# Altium project PCB_Project_DoubleBLDC.PrjPcb
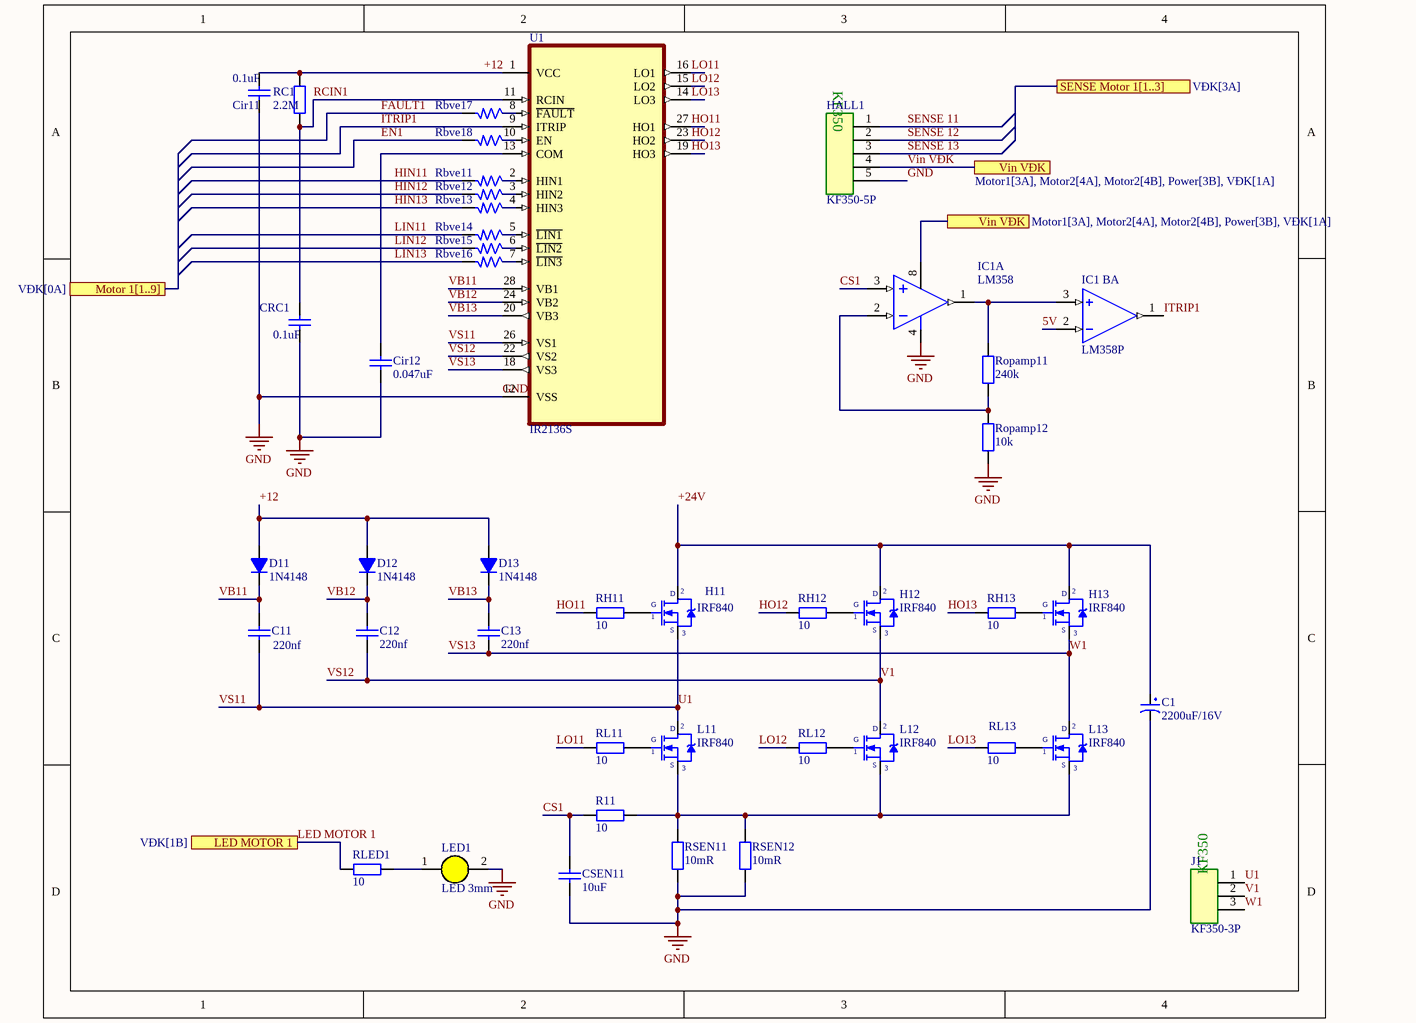
[diagram p0: Motor1.SchDoc]
4 sheets, 105 parts. Net scope: global (net labels, ports and power ports of the same name join across sheets).
Board file: DoubleBLDC.PcbDoc
Sheets:
  Motor1.SchDoc
  Motor2.SchDoc
  Power.SchDoc
  VĐK.SchDoc

## Sheet Motor1.SchDoc
size A; SheetNumber: 1; SheetTotal: 4

### Parts
C1  2200uF/16V  [CP2/4]
C11  value 220nf  [Tu-pico]  (hidden comment: Capacitor Ceramic)
C12  value 220nf  [Tu-pico]  (hidden comment: Capacitor Ceramic)
C13  value 220nf  [Tu-pico]  (hidden comment: Capacitor Ceramic)
Cir11  value 0.1uF  [Tu-pico]  (hidden comment: Capacitor Ceramic)
Cir12  value 0.047uF  [Tu-pico]  (hidden comment: Capacitor Ceramic)
CRC1  value 0.1uF  [Tu-pico]  (hidden comment: Capacitor Ceramic)
CSEN11  value 10uF  [Tu-pico]  (hidden comment: Capacitor Ceramic)
D11  1N4148  [D0.5A]
D12  1N4148  [D0.5A]
D13  1N4148  [D0.5A]
H11  IRF840  [QTO-220]
H12  IRF840  [QTO-220]
H13  IRF840  [QTO-220]
HALL1  KF350-5P  [KF350-5P]
IC1  LM358  [DIP8/W0.3]  (part A of 2)
IC1_B  LM358P  [DIP794W45P254L959H508Q8]  (part A of 3)
J1  KF350-3P  [KF350-3P]
L11  IRF840  [QTO-220]
L12  IRF840  [QTO-220]
L13  IRF840  [QTO-220]
LED1  LED 3mm  [LED-3MM-YELLOW]
R11  10  [R1/4W]
Rbve11  1m  [SM-1206]  (value not drawn)
Rbve12  1m  [SM-1206]  (value not drawn)
Rbve13  1m  [SM-1206]  (value not drawn)
Rbve14  1m  [SM-1206]  (value not drawn)
Rbve15  1m  [SM-1206]  (value not drawn)
Rbve16  1m  [SM-1206]  (value not drawn)
Rbve17  1m  [SM-1206]  (value not drawn)
Rbve18  1m  [SM-1206]  (value not drawn)
RC1  2.2M  [R1/4W]
RH11  10  [R1/4W]
RH12  10  [R1/4W]
RH13  10  [R1/4W]
RL11  10  [R1/4W]
RL12  10  [R1/4W]
RL13  10  [R1/4W]
RLED1  10  [R1/4W]
Ropamp11  240k  [R1/4W]
Ropamp12  10k  [R1/4W]
RSEN11  10mR  [Shunt 10mR 1.2x10x7MM]
RSEN12  10mR  [Shunt 10mR 1.2x10x7MM]
U1  IR2136S  [SOIC127PX1032X265-28N]

### Ports
LED MOTOR 1 (see VĐK[1B]), Motor 1[1..9] (see VĐK[0A]), SENSE Motor 1[1..3] (see VĐK[3A]), Vin VĐK (see Motor1[3A], Motor2[4A], Motor2[4B], Power[3B], VĐK[1A])

### Nets
GND: C1.2 Cir11.2 Cir12.2 CRC1.2 CSEN11.2 HALL1.5 IC1.4(-V) LED1.2(K) Ropamp12.2 RSEN11.1 RSEN12.1 U1.12(VSS)
5V: IC1_B.2(-IN1)
+12: Cir11.1 D11.1(A) D12.1(A) D13.1(A) RC1.2 U1.1(VCC)
+24V: C1.1 H11.2(D) H12.2(D) H13.2(D)
CS1: CSEN11.1 IC1.3(IN+) R11.2
EN1: Rbve18.2
FAULT1: Rbve17.2
HIN11: Rbve11.2
HIN12: Rbve12.2
HIN13: Rbve13.2
HO11: RH11.1 U1.27(HO1)
HO12: RH12.1 U1.23(HO2)
HO13: RH13.1 U1.19(HO3)
ITRIP1: IC1_B.1(OUT1) U1.9(ITRIP)
LED MOTOR 1: RLED1.2 ; port LED MOTOR 1
LIN11: Rbve14.2
LIN12: Rbve15.2
LIN13: Rbve16.2
LO11: RL11.1 U1.16(LO1)
LO12: RL12.1 U1.15(LO2)
LO13: RL13.2 U1.14(LO3)
RCIN1: CRC1.1 RC1.1 U1.11(RCIN)
SENSE 11: HALL1.1
SENSE 12: HALL1.2
SENSE 13: HALL1.3
U1: C11.2 H11.3(S) J1.1 L11.2(D) U1.26(VS1)  [also labelled VS11]
V1: C12.2 H12.3(S) J1.2 L12.2(D) U1.22(VS2)  [also labelled VS12]
VB11: C11.1 D11.2(K) U1.28(VB1)
VB12: C12.1 D12.2(K) U1.24(VB2)
VB13: C13.1 D13.2(K) U1.20(VB3)
Vin VĐK: HALL1.4 IC1.8(+V) ; port Vin VĐK
VS13: C13.2 H13.3(S) J1.3 L13.2(D) U1.18(VS3)  [also labelled W1]
NetCir12_1: Cir12.1 U1.13(COM)
NetH11_1: H11.1(G) RH11.2
NetH12_1: H12.1(G) RH12.2
NetH13_1: H13.1(G) RH13.2
NetIC1_1: IC1.1(OUT) IC1_B.3(+IN1) Ropamp11.1
NetIC1_2: IC1.2(IN-) Ropamp11.2 Ropamp12.1
NetL11_1: L11.1(G) RL11.2
NetL11_3: L11.3(S) L12.3(S) L13.3(S) R11.1 RSEN11.2 RSEN12.2
NetL12_1: L12.1(G) RL12.2
NetL13_1: L13.1(G) RL13.1
NetLED1_1: LED1.1(A) RLED1.1
NetRbve11_1: Rbve11.1 U1.2(HIN1)
NetRbve12_1: Rbve12.1 U1.3(HIN2)
NetRbve13_1: Rbve13.1 U1.4(HIN3)
NetRbve14_1: Rbve14.1 U1.5(~{LIN1})
NetRbve15_1: Rbve15.1 U1.6(~{LIN2})
NetRbve16_1: Rbve16.1 U1.7(~{LIN3})
NetRbve17_1: Rbve17.1 U1.8(~{FAULT})
NetRbve18_1: Rbve18.1 U1.10(EN)

### Notes on the sheet
- (in symbol KF350-3P) KF350
- (in symbol KF350-5P) KF350

### Library data of the parts
C1 = CP5: Cap 2200uF/16V - 1000uF/50V; Description 5: 47uF/200V - 22uF/350V - 400V - 10uF/450V; Description 1: 4700uF-6800uF/6,3V - 3300uF-4700uF/10V; Description 2: 2200uF-3300uF/16V - 470uF => 2200uF/25V; Description 3: 1000uF/35V-50V_470uF/63V_220uF>330uF/100V; Description 4: 47uF => 100uF/160V - 33uF-47uF/250V; Value: 2200uF/16V
C11-C13 Cir11 Cir12 CRC1 CSEN11 = CapCeramic: Capacitor; Published: 8-Jun-2000; LatestRevisionDate: 17-Jul-2002; LatestRevisionNote: Re-released for DXP Platform.; PackageReference: RAD-0.3; Publisher: Altium Limited
D11-D13 = D0.5A: Value: 1N4148
H11-H13 L11-L13 = IRF840: MOSFET N - CHANNEL 500V - 0.75 - 8A - TO-220; Value: IRF840
IC1 = LM358: Low-Power Dual Operational Amplifier; Value: LM358
IC1_B = LM358P: Dual, 30-V, 700-kHz operational amplifier; MF: Texas Instruments; SnapEDA_Link: https://www.snapeda.com/parts/LM358P/Texas+Instruments/view-part/?ref=snap; Package: PDIP-8 Texas; Value: *; MP: LM358P; Check_prices: https://www.snapeda.com/parts/LM358P/Texas+Instruments/view-part/?ref=eda
LED1 = LED 3mm Vang: Cắm; Don_Vi: Con; Ma_Hang: MH003893; Ten_Linh_Kien: Led 3MM Phủ Vàng (10c); Ghi_Chu: *; Kieu_Chan: *; Chung_Loai: Cắm
R11 RC1 RH11-RH13 RL11-RL13 RLED1 Ropamp11 Ropamp12 = R1/4W: Resistor 1/4W; Value: R1/4W - 1K
Rbve11-Rbve18 = R: Resistor 1/4W; Value: R1/4W - 1K
RSEN11 RSEN12 = Shunt 10mR 1.2x10x7MM
U1 = IR2136S: IC Ä‘iá»u khiá»ƒn ná»­a cáº§u cá»•ng Ä‘áº£o ngÆ°á»£c 28-SOIC; MF: Infineon; Package: SOIC-28 Infineon; Availability: Unavailable; MP: IR2136S; Value: *; SnapEDA_Link: https://www.snapeda.com/parts/IR2136S/Infineon%20Technologies/view-part/652863/?ref=snap; Price: None

## Sheet Motor2.SchDoc
size A; SheetNumber: 2; SheetTotal: 4
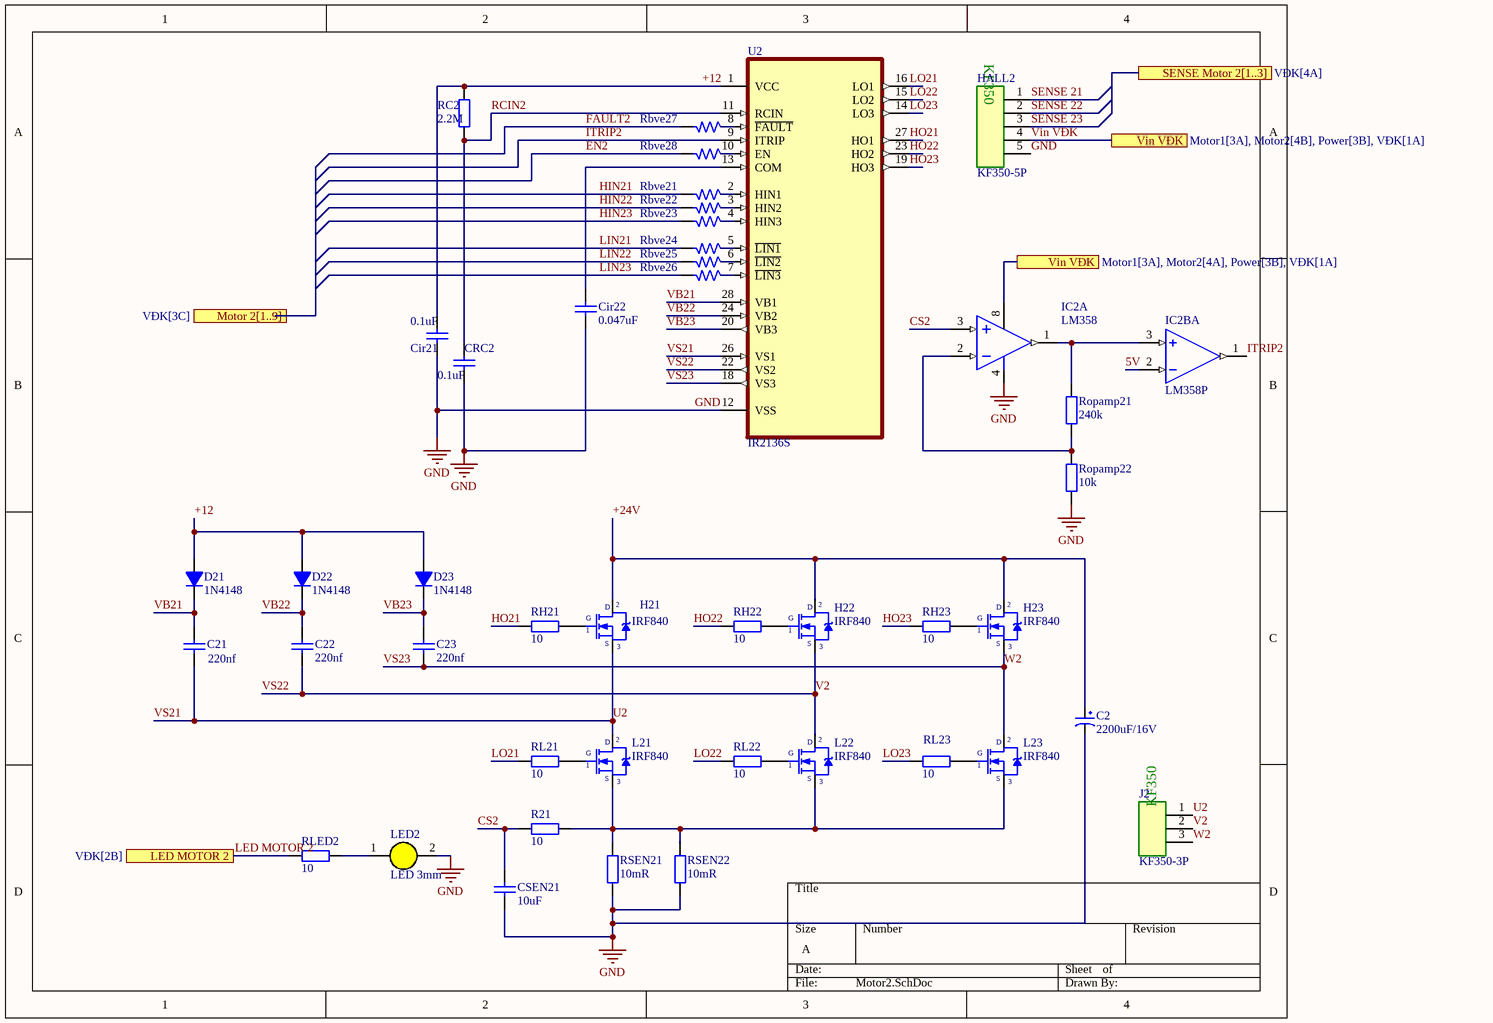
[diagram p1: Motor2.SchDoc]

### Parts
C2  2200uF/16V  [CP2/4]
C21  value 220nf  [Tu-pico]  (hidden comment: Capacitor Ceramic)
C22  value 220nf  [Tu-pico]  (hidden comment: Capacitor Ceramic)
C23  value 220nf  [Tu-pico]  (hidden comment: Capacitor Ceramic)
Cir21  value 0.1uF  [Tu-pico]  (hidden comment: Capacitor Ceramic)
Cir22  value 0.047uF  [Tu-pico]  (hidden comment: Capacitor Ceramic)
CRC2  value 0.1uF  [Tu-pico]  (hidden comment: Capacitor Ceramic)
CSEN21  value 10uF  [Tu-pico]  (hidden comment: Capacitor Ceramic)
D21  1N4148  [D0.5A]
D22  1N4148  [D0.5A]
D23  1N4148  [D0.5A]
H21  IRF840  [QTO-220]
H22  IRF840  [QTO-220]
H23  IRF840  [QTO-220]
HALL2  KF350-5P  [KF350-5P]
IC2  LM358  [DIP8/W0.3]  (part A of 2)
IC2B  LM358P  [DIP794W45P254L959H508Q8]  (part A of 3)
J2  KF350-3P  [KF350-3P]
L21  IRF840  [QTO-220]
L22  IRF840  [QTO-220]
L23  IRF840  [QTO-220]
LED2  LED 3mm  [LED-3MM-YELLOW]
R21  10  [R1/4W]
Rbve21  1m  [SM-1206]  (value not drawn)
Rbve22  1m  [SM-1206]  (value not drawn)
Rbve23  1m  [SM-1206]  (value not drawn)
Rbve24  1m  [SM-1206]  (value not drawn)
Rbve25  1m  [SM-1206]  (value not drawn)
Rbve26  1m  [SM-1206]  (value not drawn)
Rbve27  1m  [SM-1206]  (value not drawn)
Rbve28  1m  [SM-1206]  (value not drawn)
RC2  2.2M  [R1/4W]
RH21  10  [R1/4W]
RH22  10  [R1/4W]
RH23  10  [R1/4W]
RL21  10  [R1/4W]
RL22  10  [R1/4W]
RL23  10  [R1/4W]
RLED2  10  [R1/4W]
Ropamp21  240k  [R1/4W]
Ropamp22  10k  [R1/4W]
RSEN21  10mR  [Shunt 10mR 1.2x10x7MM]
RSEN22  10mR  [Shunt 10mR 1.2x10x7MM]
U2  IR2136S  [SOIC127PX1032X265-28N]

### Ports
LED MOTOR 2 (see VĐK[2B]), Motor 2[1..9] (see VĐK[3C]), SENSE Motor 2[1..3] (see VĐK[4A]), Vin VĐK (see Motor1[3A], Motor2[4A], Power[3B], VĐK[1A]), Vin VĐK (see Motor1[3A], Motor2[4B], Power[3B], VĐK[1A])

### Nets
GND: C2.2 Cir21.2 Cir22.2 CRC2.2 CSEN21.2 HALL2.5 IC2.4(-V) LED2.2(K) Ropamp22.2 RSEN21.1 RSEN22.1 U2.12(VSS)
5V: IC2B.2(-IN1)
+12: Cir21.1 D21.1(A) D22.1(A) D23.1(A) RC2.2 U2.1(VCC)
+24V: C2.1 H21.2(D) H22.2(D) H23.2(D)
CS2: CSEN21.1 IC2.3(IN+) R21.2
EN2: Rbve28.2
FAULT2: Rbve27.2
HIN21: Rbve21.2
HIN22: Rbve22.2
HIN23: Rbve23.2
HO21: RH21.1 U2.27(HO1)
HO22: RH22.1 U2.23(HO2)
HO23: RH23.1 U2.19(HO3)
ITRIP2: IC2B.1(OUT1) U2.9(ITRIP)
LED MOTOR 2: RLED2.2 ; port LED MOTOR 2
LIN21: Rbve24.2
LIN22: Rbve25.2
LIN23: Rbve26.2
LO21: RL21.1 U2.16(LO1)
LO22: RL22.1 U2.15(LO2)
LO23: RL23.2 U2.14(LO3)
RCIN2: CRC2.1 RC2.1 U2.11(RCIN)
SENSE 21: HALL2.1
SENSE 22: HALL2.2
SENSE 23: HALL2.3
U2: C21.2 H21.3(S) J2.1 L21.2(D) U2.26(VS1)  [also labelled VS21]
V2: C22.2 H22.3(S) J2.2 L22.2(D) U2.22(VS2)  [also labelled VS22]
VB21: C21.1 D21.2(K) U2.28(VB1)
VB22: C22.1 D22.2(K) U2.24(VB2)
VB23: C23.1 D23.2(K) U2.20(VB3)
Vin VĐK: HALL2.4 IC2.8(+V) ; port Vin VĐK
VS23: C23.2 H23.3(S) J2.3 L23.2(D) U2.18(VS3)  [also labelled W2]
NetCir22_1: Cir22.1 U2.13(COM)
NetH21_1: H21.1(G) RH21.2
NetH22_1: H22.1(G) RH22.2
NetH23_1: H23.1(G) RH23.2
NetIC2_1: IC2.1(OUT) IC2B.3(+IN1) Ropamp21.1
NetIC2_2: IC2.2(IN-) Ropamp21.2 Ropamp22.1
NetL21_1: L21.1(G) RL21.2
NetL21_3: L21.3(S) L22.3(S) L23.3(S) R21.1 RSEN21.2 RSEN22.2
NetL22_1: L22.1(G) RL22.2
NetL23_1: L23.1(G) RL23.1
NetLED2_1: LED2.1(A) RLED2.1
NetRbve21_1: Rbve21.1 U2.2(HIN1)
NetRbve22_1: Rbve22.1 U2.3(HIN2)
NetRbve23_1: Rbve23.1 U2.4(HIN3)
NetRbve24_1: Rbve24.1 U2.5(~{LIN1})
NetRbve25_1: Rbve25.1 U2.6(~{LIN2})
NetRbve26_1: Rbve26.1 U2.7(~{LIN3})
NetRbve27_1: Rbve27.1 U2.8(~{FAULT})
NetRbve28_1: Rbve28.1 U2.10(EN)

### Notes on the sheet
- (in symbol KF350-3P) KF350
- (in symbol KF350-5P) KF350

### Library data of the parts
C2 = CP5: as C1 on sheet Motor1; Value: 2200uF/16V
C21-C23 Cir21 Cir22 CRC2 CSEN21 = CapCeramic: Capacitor; Published: 8-Jun-2000; LatestRevisionDate: 17-Jul-2002; LatestRevisionNote: Re-released for DXP Platform.; PackageReference: RAD-0.3; Publisher: Altium Limited
D21-D23 = D0.5A: Value: 1N4148
H21-H23 L21-L23 = IRF840: as H11 on sheet Motor1; Value: IRF840
IC2 = LM358: Low-Power Dual Operational Amplifier; Value: LM358
IC2B = LM358P: as IC1_B on sheet Motor1; SnapEDA_Link: https://www.snapeda.com/parts/LM358P/Texas+Instruments/view-part/?ref=snap; Package: PDIP-8 Texas; Value: *; MP: LM358P; Check_prices: https://www.snapeda.com/parts/LM358P/Texas+Instruments/view-part/?ref=eda
LED2 = LED 3mm Vang: as LED1 on sheet Motor1; Ghi_Chu: *; Kieu_Chan: *; Chung_Loai: Cắm
R21 RC2 RH21-RH23 RL21-RL23 RLED2 Ropamp21 Ropamp22 = R1/4W: Resistor 1/4W; Value: R1/4W - 1K
Rbve21-Rbve28 = R: Resistor 1/4W; Value: R1/4W - 1K
RSEN21 RSEN22 = Shunt 10mR 1.2x10x7MM
U2 = IR2136S: as U1 on sheet Motor1; Package: SOIC-28 Infineon; Availability: Unavailable; MP: IR2136S; Value: *; SnapEDA_Link: https://www.snapeda.com/parts/IR2136S/Infineon%20Technologies/view-part/652863/?ref=snap; Price: None

## Sheet Power.SchDoc
size A; SheetNumber: 3; SheetTotal: 4
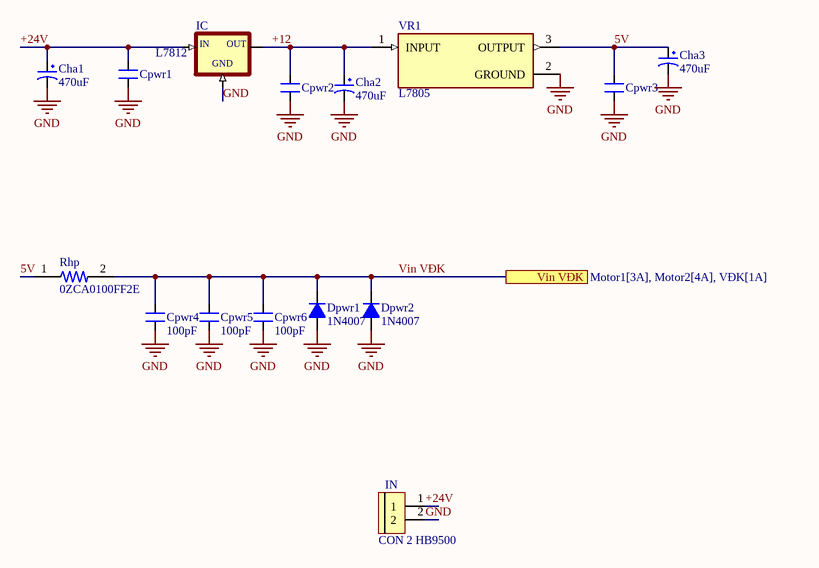
[diagram p2: Power.SchDoc]

### Parts
Cha1  470uF  [CP1.5/3.4]
Cha2  470uF  [CP1.5/3.4]
Cha3  470uF  [CP1.5/3.4]
Cpwr1  100pF  [CN1]  (value not drawn)
Cpwr2  100pF  [CN1]  (value not drawn)
Cpwr3  100pF  [CN1]  (value not drawn)
Cpwr4  100pF  [CN1]
Cpwr5  100pF  [CN1]
Cpwr6  100pF  [CN1]
Dpwr1  1N4007  [D0.5A]
Dpwr2  1N4007  [D0.5A]
IC  L7812  [78XXS]
IN  CON 2 HB9500  [CON 2 HB9500]
Rhp  0ZCA0100FF2E  [RESC3216X125N]
VR1  L7805  [TO255P1020X450X2000-3]

### Ports
Vin VĐK (see Motor1[3A], Motor2[4A], VĐK[1A])

### Nets
GND: Cha1.2 Cha2.2 Cha3.2 Cpwr1.2 Cpwr2.2 Cpwr3.2 Cpwr4.2 Cpwr5.2 Cpwr6.2 Dpwr1.1(A) Dpwr2.1(A) IC.GND IN.2 VR1.2(GROUND)
5V: Cha3.1 Cpwr3.1 Rhp.1 VR1.3(OUTPUT)
+12: Cha2.1 Cpwr2.1 IC.OUT VR1.1(INPUT)
+24V: Cha1.1 Cpwr1.1 IC.IN IN.1
Vin VĐK: Cpwr4.1 Cpwr5.1 Cpwr6.1 Dpwr1.2(K) Dpwr2.2(K) Rhp.2 ; port Vin VĐK

### Library data of the parts
Cha1-Cha3 = CP4: Cap 1000uF/16V - 220uF/50V; Description 5: 4,7uF>10uF/250V_3,3uF>10uF/400V - 2,2uF>4,7uF/450V; Description 1: 2200uF-3300uF/6,3V - 1000uF-2200uF/10V; Description 2: 1000uF/16V - 470uF => 1000uF/25V - 100uF/100V; Description 3: 330uF>470uF/35V_220uF>470uF/50V_10uF>22uF/250V; Description 4: 220uF => 330uF/63V - 10uF =>33uF/160 - 200V; Value: 1000uF/16V
Cpwr1-Cpwr6 = CN1: Cap np  1pF - 472pF; Value: 100pF
Dpwr1 Dpwr2 = D1A: Diode 1A; Value: 1N4007
IC = L7812: Linear Voltage Regulator IC 1 Output 1.5A D2PAK; MF: STMicroelectronics; Value: *; SnapEDA_Link: https://www.snapeda.com/parts/L7812/STMicroelectronics/view-part/562240/?ref=snap; Package: D2PAK STMicroelectronics; MP: L7812; Availability: Unavailable; Price: None
IN = CON 2 HB9500: Cắm; Ma_Hang: MH002054; Ten_Linh_Kien: CON 2 HB9500-2P 9.5MM; Chung_Loai: Cắm; Ghi_Chu: *; Kieu_Chan: *; Don_Vi: Con
Rhp = 0ZCA0100FF2E: Polymeric PTC Resettable Fuse 6V 1 A Ih Surface Mount 1206 (3216 Metric), Concave; MF: Bel Fuse; Check_prices: https://www.snapeda.com/parts/0ZCA0100FF2E/Bel+Fuse+Inc./view-part/?ref=eda; Value: *; Availability: In Stock; MP: 0ZCA0100FF2E; Price: None; Package: 1206 Bel Fuse; SnapEDA_Link: https://www.snapeda.com/parts/0ZCA0100FF2E/Bel+Fuse+Inc./view-part/?ref=snap; Purchase-URL: https://pricing.snapeda.com/search/part/0ZCA0100FF2E/?ref=eda
VR1 = L7805: Standard Regulator Pos 5V 1.5A 3-Pin(3+Tab) TO-220FP Tube; MF: STMicroelectronics; MP: L7805; Value: *; SnapEDA_Link: https://www.snapeda.com/parts/L7805/STMicroelectronics/view-part/?ref=snap; Price: None; Package: None; Check_prices: https://www.snapeda.com/parts/L7805/STMicroelectronics/view-part/?ref=eda; Availability: Not in stock

## Sheet VĐK.SchDoc
size A4; SheetNumber: 4; SheetTotal: 4
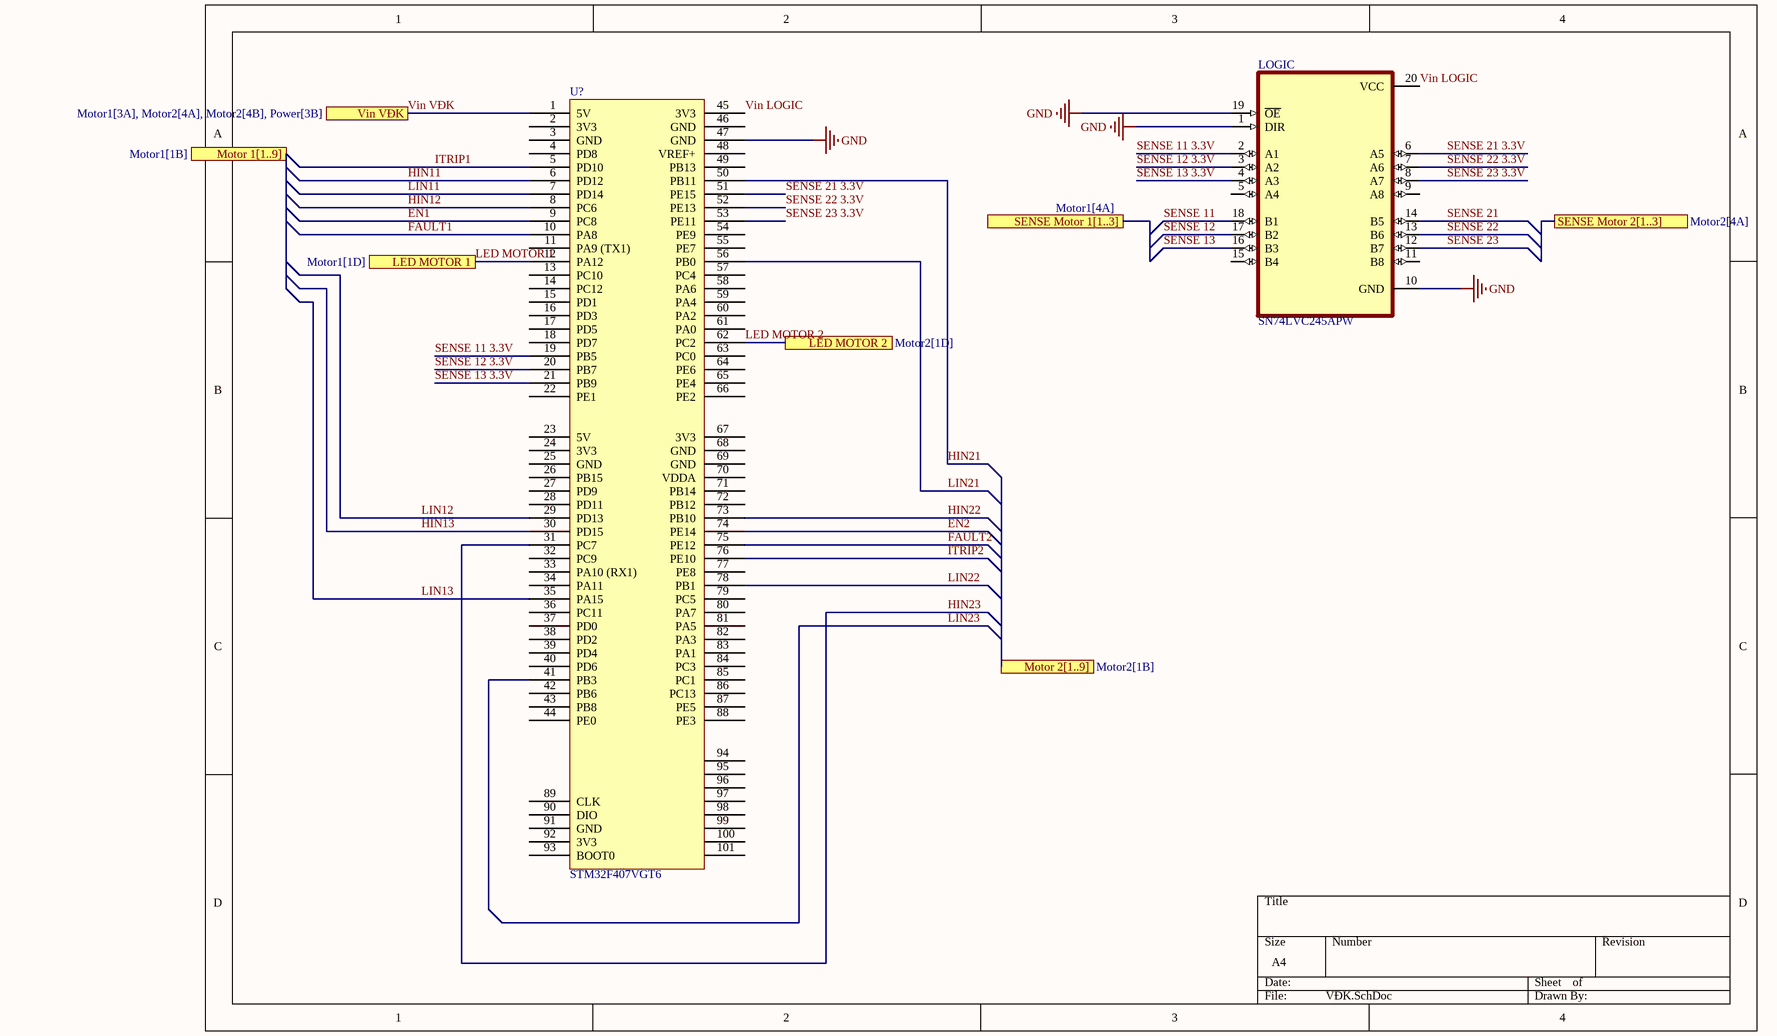
[diagram p3: VĐK.SchDoc]

### Parts
LOGIC  SN74LVC245APW  [SOP65P640X120-20N]
U?  STM32F407VGT6  [STM32F407VGT6]

### Ports
LED MOTOR 1 (see Motor1[1D]), LED MOTOR 2 (see Motor2[1D]), Motor 1[1..9] (see Motor1[1B]), Motor 2[1..9] (see Motor2[1B]), SENSE Motor 1[1..3] (see Motor1[4A]), SENSE Motor 2[1..3] (see Motor2[4A]), Vin VĐK (see Motor1[3A], Motor2[4A], Motor2[4B], Power[3B])

### Nets
GND: LOGIC.1(DIR) LOGIC.10(GND) LOGIC.19(~{OE}) U?.47(GND)
EN1: U?.9(PC8)
EN2: U?.74(PE14)
FAULT1: U?.10(PA8)
FAULT2: U?.75(PE12)
HIN11: U?.6(PD12)
HIN12: U?.8(PC6)
HIN13: U?.30(PD15)
HIN21: U?.50(PB11)
HIN22: U?.73(PB10)
HIN23: U?.31(PC7)
ITRIP1: U?.5(PD10)
ITRIP2: U?.76(PE10)
LED MOTOR 1: U?.12(PA12) ; port LED MOTOR 1
LED MOTOR 2: U?.62(PC2) ; port LED MOTOR 2
LIN11: U?.7(PD14)
LIN12: U?.29(PD13)
LIN13: U?.35(PA15)
LIN21: U?.56(PB0)
LIN22: U?.78(PB1)
LIN23: U?.41(PB3)
SENSE 11: LOGIC.18(B1)
SENSE 11 3.3V: LOGIC.2(A1) U?.19(PB5)
SENSE 12: LOGIC.17(B2)
SENSE 12 3.3V: LOGIC.3(A2) U?.20(PB7)
SENSE 13: LOGIC.16(B3)
SENSE 13 3.3V: LOGIC.4(A3) U?.21(PB9)
SENSE 21: LOGIC.14(B5)
SENSE 21 3.3V: LOGIC.6(A5) U?.51(PE15)
SENSE 22: LOGIC.13(B6)
SENSE 22 3.3V: LOGIC.7(A6) U?.52(PE13)
SENSE 23: LOGIC.12(B7)
SENSE 23 3.3V: LOGIC.8(A7) U?.53(PE11)
Vin LOGIC: LOGIC.20(VCC) U?.45(3V3)
Vin VĐK: U?.1(5V) ; port Vin VĐK

Not connected (* = marked no-connect by the designer): LOGIC 5(A4) 9(A8) 11(B8) 15(B4); U? 2(3V3) 3(GND) 4(PD8) 11(PA9_(TX1)) 13(PC10) 14(PC12) 15(PD1) 16(PD3) 17(PD5) 18(PD7) 22(PE1) 23(5V) 24(3V3) 25(GND) 26(PB15) 27(PD9) 28(PD11) 32(PC9) 33(PA10_(RX1)) 34(PA11) 36(PC11) 37(PD0) 38(PD2) 39(PD4) 40(PD6) 42(PB6) 43(PB8) 44(PE0) 46(GND) 48(VREF+) 49(PB13) 54(PE9) 55(PE7) 57(PC4) 58(PA6) 59(PA4) 60(PA2) 61(PA0) 63(PC0) 64(PE6) 65(PE4) 66(PE2) 67(3V3) 68(GND) 69(GND) 70(VDDA) 71(PB14) 72(PB12) 77(PE8) 79(PC5) 80(PA7) 81(PA5) 82(PA3) 83(PA1) 84(PC3) 85(PC1) 86(PC13) 87(PE5) 88(PE3) 89(CLK) 90(DIO) 91(GND) 92(3V3) 93(BOOT0) 94 95 96 97 98 99 100 101

### Library data of the parts
LOGIC = SN74LVC245APW: Octal Bus Transceiver With 3-State Outputs 20-TSSOP -40 to 125; MF: Texas Instruments; Package: TSSOP-20 Texas Instruments; MP: SN74LVC245APW; Price: None; Availability: Warning; Purchase-URL: https://pricing.snapeda.com/search/part/SN74LVC245APW/?ref=eda; Check_prices: https://www.snapeda.com/parts/SN74LVC245APW/Texas%20Instruments/view-part/318075/?ref=eda; Value: *; SnapEDA_Link: https://www.snapeda.com/parts/SN74LVC245APW/Texas%20Instruments/view-part/318075/?ref=snap

## Nets that join several sheets
GND: Motor1 (12 pins), Motor2 (12 pins), Power (14 pins), VĐK (LOGIC.1 LOGIC.10 LOGIC.19 U?.47)
5V: Motor1 (IC1_B.2), Motor2 (IC2B.2), Power (Cha3.1 Cpwr3.1 Rhp.1 VR1.3)
+12: Motor1 (6 pins), Motor2 (6 pins), Power (Cha2.1 Cpwr2.1 IC.OUT VR1.1)
+24V: Motor1 (C1.1 H11.2 H12.2 H13.2), Motor2 (C2.1 H21.2 H22.2 H23.2), Power (Cha1.1 Cpwr1.1 IC.IN IN.1)
EN1: Motor1 (Rbve18.2), VĐK (U?.9)
EN2: Motor2 (Rbve28.2), VĐK (U?.74)
FAULT1: Motor1 (Rbve17.2), VĐK (U?.10)
FAULT2: Motor2 (Rbve27.2), VĐK (U?.75)
HIN11: Motor1 (Rbve11.2), VĐK (U?.6)
HIN12: Motor1 (Rbve12.2), VĐK (U?.8)
HIN13: Motor1 (Rbve13.2), VĐK (U?.30)
HIN21: Motor2 (Rbve21.2), VĐK (U?.50)
HIN22: Motor2 (Rbve22.2), VĐK (U?.73)
HIN23: Motor2 (Rbve23.2), VĐK (U?.31)
ITRIP1: Motor1 (IC1_B.1 U1.9), VĐK (U?.5)
ITRIP2: Motor2 (IC2B.1 U2.9), VĐK (U?.76)
LED MOTOR 1: Motor1 (RLED1.2), VĐK (U?.12)
LED MOTOR 2: Motor2 (RLED2.2), VĐK (U?.62)
LIN11: Motor1 (Rbve14.2), VĐK (U?.7)
LIN12: Motor1 (Rbve15.2), VĐK (U?.29)
LIN13: Motor1 (Rbve16.2), VĐK (U?.35)
LIN21: Motor2 (Rbve24.2), VĐK (U?.56)
LIN22: Motor2 (Rbve25.2), VĐK (U?.78)
LIN23: Motor2 (Rbve26.2), VĐK (U?.41)
SENSE 11: Motor1 (HALL1.1), VĐK (LOGIC.18)
SENSE 12: Motor1 (HALL1.2), VĐK (LOGIC.17)
SENSE 13: Motor1 (HALL1.3), VĐK (LOGIC.16)
SENSE 21: Motor2 (HALL2.1), VĐK (LOGIC.14)
SENSE 22: Motor2 (HALL2.2), VĐK (LOGIC.13)
SENSE 23: Motor2 (HALL2.3), VĐK (LOGIC.12)
Vin VĐK: Motor1 (HALL1.4 IC1.8), Motor2 (HALL2.4 IC2.8), Power (6 pins), VĐK (U?.1)